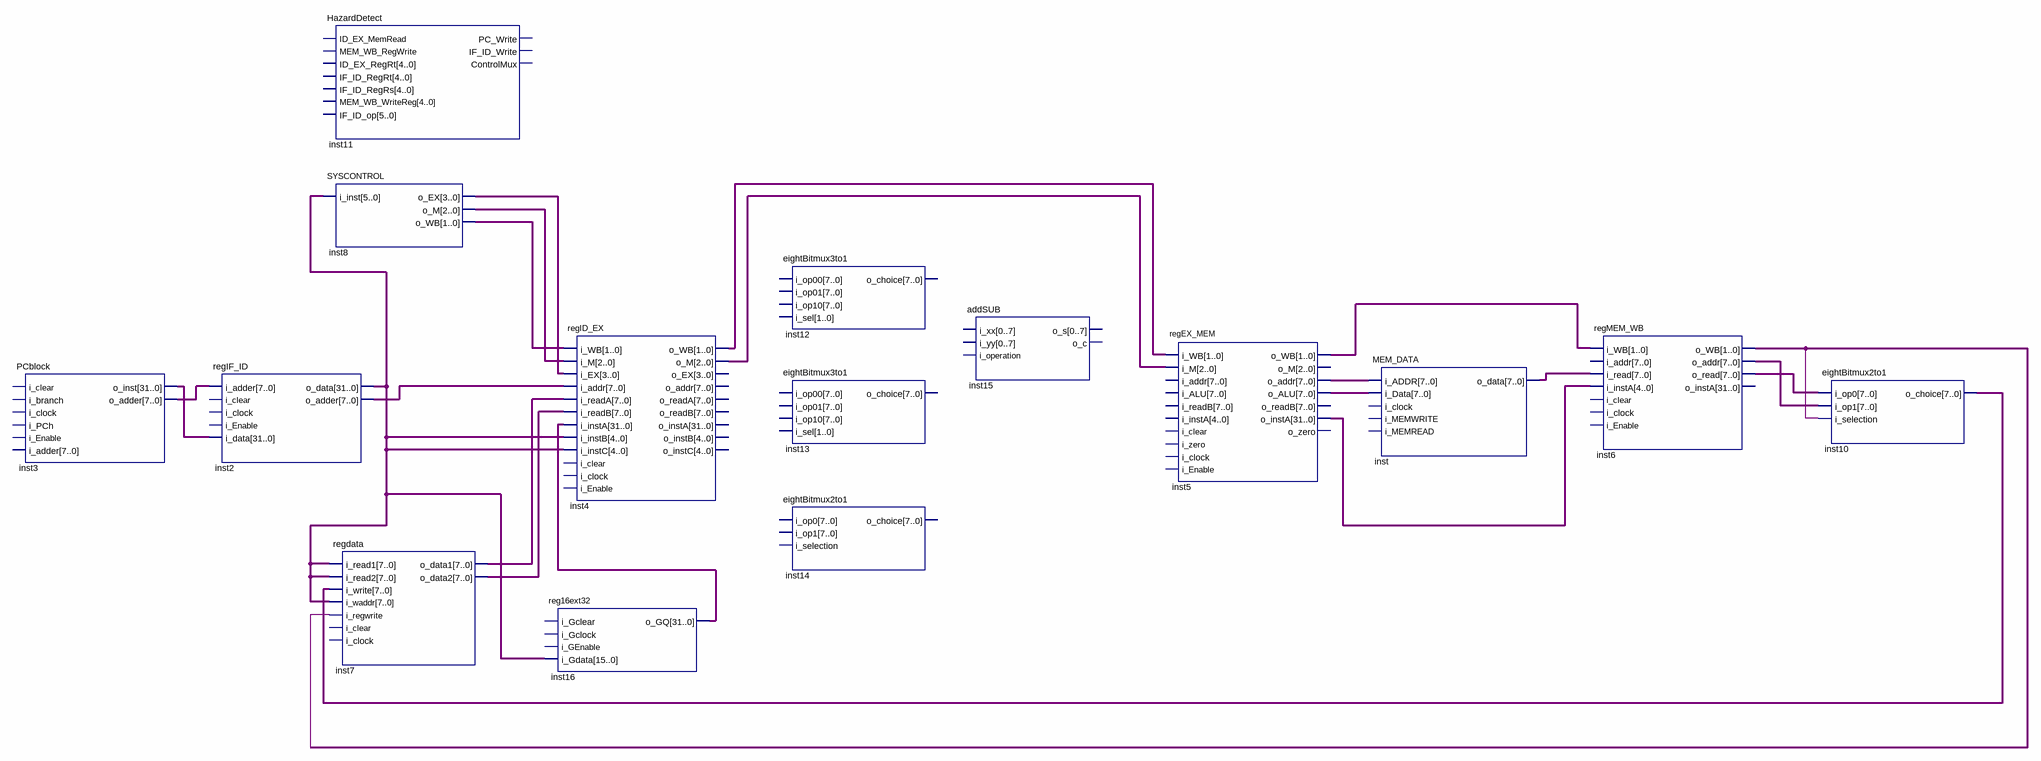
[diagram p0: schematic sheet]
// Quartus schematic mips.bdf as structural Verilog: 15 symbols, 0 pins
module mips (
);

  wire undriven, undriven_2;
  wire [1:0] inst4_o_wb, inst5_o_wb, inst6_o_wb, inst8_o_wb;
  wire [2:0] inst4_o_m, inst8_o_m;
  wire [3:0] inst8_o_ex;
  wire [7:0] inst2_o_adder, inst3_o_adder, inst5_o_addr, inst5_o_alu, inst6_o_addr, inst6_o_read,
       inst7_o_data1, inst7_o_data2, inst10_o_choice, inst_o_data;
  wire [31:0] inst2_o_data, inst3_o_inst, inst5_o_insta, inst16_o_gq;

  PCblock inst3 (
    .o_inst(inst3_o_inst), .o_adder(inst3_o_adder));  // open: i_clear, i_branch, i_clock, i_PCh, i_Enable, i_adder
  regIF_ID inst2 (
    .i_adder(inst3_o_adder), .i_data(inst3_o_inst), .o_data(inst2_o_data), .o_adder(inst2_o_adder));  // open: i_clear, i_clock, i_Enable
  HazardDetect inst11 ();  // open: ID_EX_MemRead, MEM_WB_RegWrite, ID_EX_RegRt, IF_ID_RegRt, IF_ID_RegRs, MEM_WB_WriteReg, IF_ID_op, PC_Write, IF_ID_Write, ControlMux
  SYSCONTROL inst8 (.i_inst(inst2_o_data), .o_EX(inst8_o_ex), .o_M(inst8_o_m), .o_WB(inst8_o_wb));
  regdata inst7 (
    .i_read1(inst2_o_data), .i_read2(inst2_o_data), .i_write(inst10_o_choice), .i_waddr(inst2_o_data),
    .i_regwrite(undriven), .o_data1(inst7_o_data1), .o_data2(inst7_o_data2));  // open: i_clear, i_clock
  regID_EX inst4 (
    .i_WB(inst8_o_wb), .i_M(inst8_o_m), .i_EX(inst8_o_ex), .i_addr(inst2_o_adder), .i_readA(inst7_o_data1),
    .i_readB(inst7_o_data2), .i_instA(inst16_o_gq), .i_instB(inst2_o_data), .i_instC(inst2_o_data),
    .o_WB(inst4_o_wb), .o_M(inst4_o_m));  // open: i_clear, i_clock, i_Enable, o_EX, o_addr, o_readA, o_readB, o_instA, o_instB, o_instC
  reg16ext32 inst16 (.i_Gdata(inst2_o_data), .o_GQ(inst16_o_gq));  // open: i_Gclear, i_Gclock, i_GEnable
  eightBitmux3to1 inst12 ();  // open: i_op00, i_op01, i_op10, i_sel, o_choice
  eightBitmux3to1 inst13 ();  // open: i_op00, i_op01, i_op10, i_sel, o_choice
  eightBitmux2to1 inst14 ();  // open: i_op0, i_op1, i_selection, o_choice
  addSUB inst15 ();  // open: i_xx, i_yy, i_operation, o_s, o_c
  regEX_MEM inst5 (
    .i_WB(inst4_o_wb), .i_M(inst4_o_m), .o_WB(inst5_o_wb), .o_addr(inst5_o_addr), .o_ALU(inst5_o_alu),
    .o_instA(inst5_o_insta));  // open: i_addr, i_ALU, i_readB, i_instA, i_clear, i_zero, i_clock, i_Enable, o_M, o_readB, o_zero
  MEM_DATA inst (
    .i_ADDR(inst5_o_addr), .i_Data(inst5_o_alu), .o_data(inst_o_data));  // open: i_clock, i_MEMWRITE, i_MEMREAD
  regMEM_WB inst6 (
    .i_WB(inst5_o_wb), .i_read(inst_o_data), .i_instA(inst5_o_insta), .o_WB(inst6_o_wb),
    .o_addr(inst6_o_addr), .o_read(inst6_o_read));  // open: i_addr, i_clear, i_clock, i_Enable, o_instA
  eightBitmux2to1 inst10 (
    .i_op0(inst6_o_read), .i_op1(inst6_o_addr), .i_selection(undriven_2), .o_choice(inst10_o_choice));
endmodule
